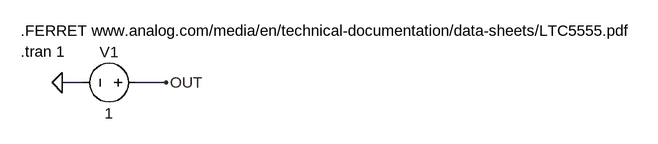
[diagram p0: schematic Fig_3-49_Fig_3-45_FERRET.asc]
Fig_3-49_Fig_3-45_FERRET.asc, the LTspice schematic file:
Version 4
SHEET 1 1668 680
WIRE 160 144 128 144
WIRE 288 144 240 144
FLAG 288 144 OUT
FLAG 128 144 0
SYMBOL voltage 256 144 R90
WINDOW 0 -32 56 VBottom 2
WINDOW 3 32 56 VTop 2
SYMATTR InstName V1
SYMATTR Value 1
TEXT 64 96 Left 2 !.tran 1
TEXT 64 64 Left 2 !.FERRET www.analog.com/media/en/technical-documentation/data-sheets/LTC5555.pdf

The netlist it stands for:
* Fig_3-49_Fig_3-45_FERRET.asc
V1 OUT 0 1
.tran 1
.FERRET www.analog.com/media/en/technical-documentation/data-sheets/LTC5555.pdf
.backanno
.end